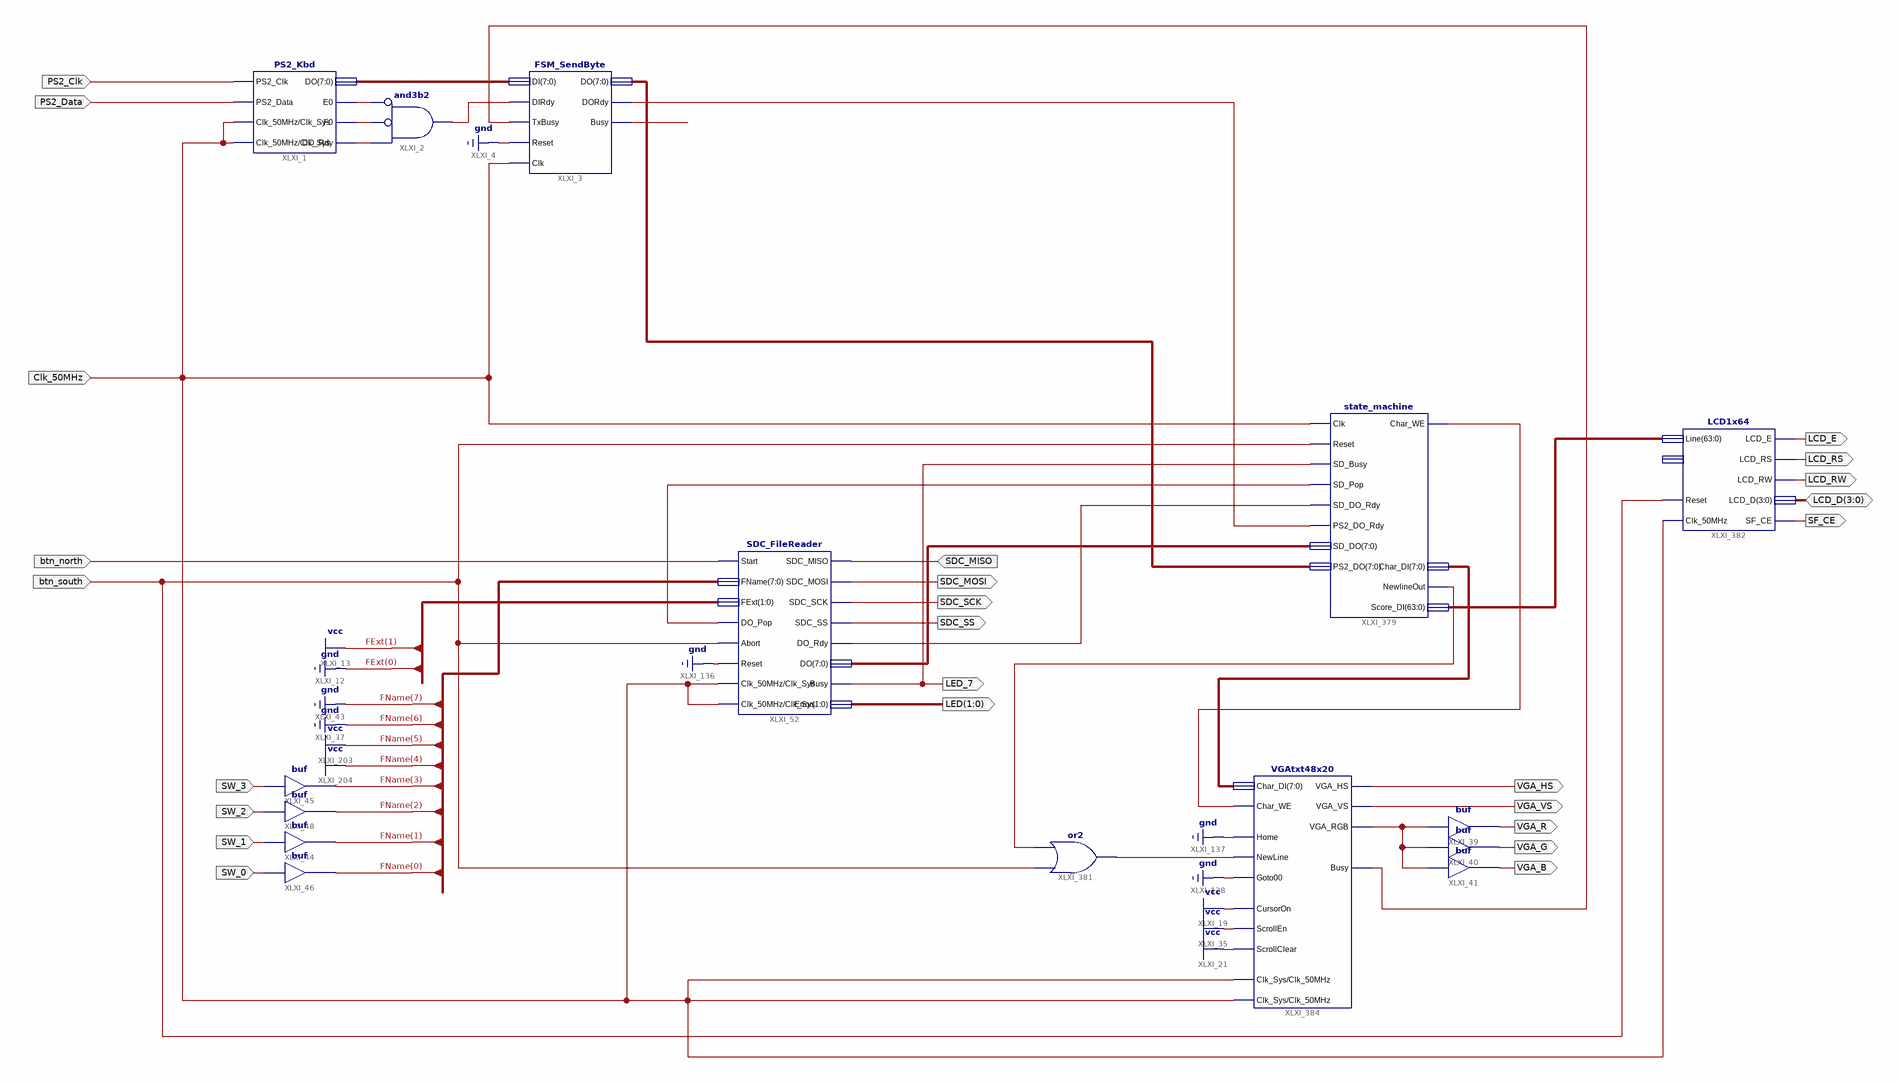
[diagram p0: schematic sheet 1]
// Xilinx ISE schematic tutor_v2.sch (spartan3e) as structural Verilog: 15 symbols, 25 ports
module tutor_v2 (
  input  PS2_Clk,
  input  PS2_Data,
  input  SDC_MISO,
  input  btn_north,
  input  Clk_50MHz,
  input  btn_south,
  input  SW_0,
  input  SW_1,
  input  SW_2,
  input  SW_3,
  inout  [3:0] LCD_D,
  output SDC_SS,
  output SDC_SCK,
  output LED_7,
  output [1:0] LED,
  output SDC_MOSI,
  output VGA_VS,
  output VGA_HS,
  output VGA_G,
  output VGA_B,
  output VGA_R,
  output LCD_E,
  output LCD_RS,
  output LCD_RW,
  output SF_CE
);

  wire XLXN_3, XLXN_5, XLXN_6, XLXN_72, XLXN_564, XLXN_1172, XLXN_1178, XLXN_1182, XLXN_1186, XLXN_1187,
       XLXN_1188, XLXN_1192, XLXN_1195;
  wire [3:0] FName;
  wire [7:0] XLXN_25, XLXN_1124, XLXN_1125, XLXN_1179;
  wire [63:0] XLXN_1207;

  PS2_Kbd XLXI_1 (
    .PS2_Clk(PS2_Clk), .PS2_Data(PS2_Data), .Clk_50MHz(Clk_50MHz), .E0(XLXN_3), .F0(XLXN_6), .DO_Rdy(XLXN_5),
    .DO(XLXN_25), .Clk_Sys(Clk_50MHz));
  and XLXI_2 (XLXN_72, ~XLXN_3, ~XLXN_6, XLXN_5);  // and3b2
  FSM_SendByte XLXI_3 (
    .Busy(XLXN_1186), .DORdy(XLXN_1172), .DO(XLXN_1124), .DI(XLXN_25), .DIRdy(XLXN_72), .TxBusy(XLXN_1187),
    .Reset(1'b0), .Clk(Clk_50MHz));
  SDC_FileReader XLXI_52 (
    .SDC_MISO(SDC_MISO), .Start(btn_north), .FName({4'b0011, FName}), .Reset(1'b0), .Clk_50MHz(Clk_50MHz),
    .DO_Pop(XLXN_1182), .Abort(btn_south), .SDC_MOSI(SDC_MOSI), .SDC_SCK(SDC_SCK), .SDC_SS(SDC_SS),
    .Error(LED), .DO(XLXN_1125), .DO_Rdy(XLXN_1188), .Busy(LED_7), .FExt(2'b10), .Clk_Sys(Clk_50MHz));
  buf XLXI_39 (VGA_R, XLXN_564);
  buf XLXI_40 (VGA_G, XLXN_564);
  buf XLXI_41 (VGA_B, XLXN_564);
  state_machine XLXI_379 (
    .Clk(Clk_50MHz), .Reset(btn_south), .SD_Busy(LED_7), .SD_DO_Rdy(XLXN_1188), .PS2_DO_Rdy(XLXN_1172),
    .SD_DO(XLXN_1125), .PS2_DO(XLXN_1124), .Char_WE(XLXN_1178), .NewlineOut(XLXN_1192), .SD_Pop(XLXN_1182),
    .Char_DI(XLXN_1179), .Score_DI(XLXN_1207));
  or XLXI_381 (XLXN_1195, btn_south, XLXN_1192);
  LCD1x64 XLXI_382 (
    .Clk_50MHz(Clk_50MHz), .Reset(btn_south), .Line(XLXN_1207), .LCD_D(LCD_D), .LCD_E(LCD_E),
    .LCD_RW(LCD_RW), .LCD_RS(LCD_RS), .SF_CE(SF_CE));  // open: Blank
  buf XLXI_45 (FName[3], SW_3);
  buf XLXI_46 (FName[0], SW_0);
  buf XLXI_44 (FName[1], SW_1);
  buf XLXI_48 (FName[2], SW_2);
  VGAtxt48x20 XLXI_384 (
    .Char_DI(XLXN_1179), .Home(1'b0), .NewLine(XLXN_1195), .Goto00(1'b0), .Clk_Sys(Clk_50MHz),
    .Clk_50MHz(Clk_50MHz), .CursorOn(1'b1), .ScrollEn(1'b1), .ScrollClear(1'b1), .Busy(XLXN_1187),
    .VGA_HS(VGA_HS), .VGA_VS(VGA_VS), .VGA_RGB(XLXN_564), .Char_WE(XLXN_1178));
endmodule
